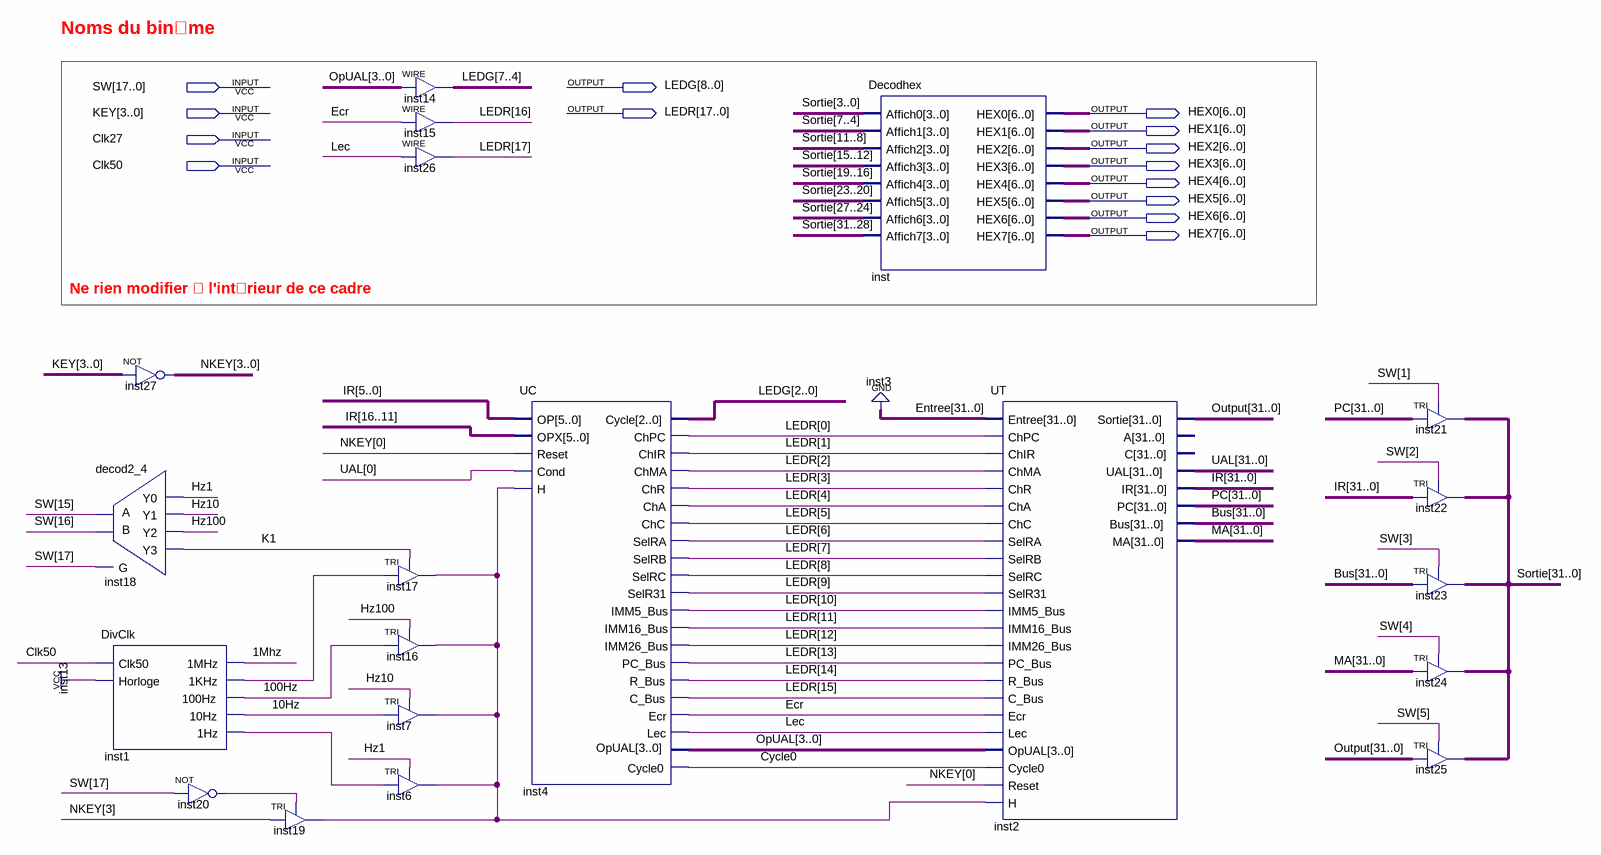
[diagram p0: schematic sheet]
// Quartus schematic DE2_backup.bdf as structural Verilog: 20 symbols, 14 pins
module DE2_backup (
  input  [17:0] SW,
  input  [3:0] KEY,
  input  Clk27,
  input  Clk50,
  output [8:0] LEDG,
  output [17:0] LEDR,
  output [6:0] HEX0,
  output [6:0] HEX1,
  output [6:0] HEX2,
  output [6:0] HEX3,
  output [6:0] HEX4,
  output [6:0] HEX5,
  output [6:0] HEX6,
  output [6:0] HEX7
);

  wire \1Mhz , \10Hz , \100Hz , Cycle0, Ecr, Hz1, Hz10, Hz100, inst1_1hz, inst1_1khz, inst19_out, inst20_out,
       K1, Lec;
  wire [3:0] NKEY, OpUAL;
  wire [31:0] Bus, IR, MA, Output, PC, Sortie, UAL;

  decod2_4 inst18 (.G(SW[17]), .A(SW[15]), .B(SW[16]), .Y0(Hz1), .Y1(Hz10), .Y2(Hz100), .Y3(K1));
  DivClk inst1 (
    .Clk50(Clk50), .Horloge(1'b1), .\1MHz (\1Mhz ), .\1KHz (inst1_1khz), .\100Hz (\100Hz ), .\10Hz (\10Hz ),
    .\1Hz (inst1_1hz));
  assign NKEY = ~KEY;  // NOT inst27, 4 bits wide
  not inst20 (inst20_out, SW[17]);
  TRI inst19 (.IN(NKEY[3]), .OE(inst20_out), .OUT(inst19_out));
  TRI inst17 (.IN(inst1_1khz), .OE(K1), .OUT(inst19_out));
  TRI inst16 (.IN(\100Hz ), .OE(Hz100), .OUT(inst19_out));
  TRI inst7 (.IN(\10Hz ), .OE(Hz10), .OUT(inst19_out));
  TRI inst6 (.IN(inst1_1hz), .OE(Hz1), .OUT(inst19_out));
  assign LEDG[7:4] = OpUAL;  // WIRE inst14
  assign LEDR[16] = Ecr;  // WIRE inst15
  assign LEDR[17] = Lec;  // WIRE inst26
  UC inst4 (
    .Reset(NKEY[0]), .Cond(UAL[0]), .H(inst19_out), .OP(IR[5:0]), .OPX(IR[16:11]), .ChPC(LEDR[0]),
    .ChIR(LEDR[1]), .ChMA(LEDR[2]), .ChR(LEDR[3]), .ChA(LEDR[4]), .ChC(LEDR[5]), .SelRA(LEDR[6]),
    .SelRB(LEDR[7]), .SelRC(LEDR[8]), .SelR31(LEDR[9]), .IMM5_Bus(LEDR[10]), .IMM16_Bus(LEDR[11]),
    .IMM26_Bus(LEDR[12]), .PC_Bus(LEDR[13]), .R_Bus(LEDR[14]), .C_Bus(LEDR[15]), .Ecr(Ecr), .Lec(Lec),
    .Cycle0(Cycle0), .Cycle(LEDG[2:0]), .OpUAL(OpUAL));
  Decodhex inst (
    .Affich0(Sortie[3:0]), .Affich1(Sortie[7:4]), .Affich2(Sortie[11:8]), .Affich3(Sortie[15:12]),
    .Affich4(Sortie[19:16]), .Affich5(Sortie[23:20]), .Affich6(Sortie[27:24]), .Affich7(Sortie[31:28]),
    .HEX0(HEX0), .HEX1(HEX1), .HEX2(HEX2), .HEX3(HEX3), .HEX4(HEX4), .HEX5(HEX5), .HEX6(HEX6), .HEX7(HEX7));
  UT inst2 (
    .Entree({32{1'b0}}), .ChPC(LEDR[0]), .ChIR(LEDR[1]), .ChMA(LEDR[2]), .ChR(LEDR[3]), .ChA(LEDR[4]),
    .ChC(LEDR[5]), .SelRA(LEDR[6]), .SelRB(LEDR[7]), .SelRC(LEDR[8]), .SelR31(LEDR[9]), .IMM5_Bus(LEDR[10]),
    .IMM16_Bus(LEDR[11]), .IMM26_Bus(LEDR[12]), .PC_Bus(LEDR[13]), .R_Bus(LEDR[14]), .C_Bus(LEDR[15]),
    .Ecr(Ecr), .Lec(Lec), .OpUAL(OpUAL), .Cycle0(Cycle0), .Reset(NKEY[0]), .H(inst19_out), .Sortie(Output),
    .UAL(UAL), .IR(IR), .PC(PC), .MA(MA), .Bus(Bus));  // open: A, C
  TRI inst21[31:0] (.IN(PC), .OE(SW[1]), .OUT(Sortie));
  TRI inst22[31:0] (.IN(IR), .OE(SW[2]), .OUT(Sortie));
  TRI inst23[31:0] (.IN(Bus), .OE(SW[3]), .OUT(Sortie));
  TRI inst24[31:0] (.IN(MA), .OE(SW[4]), .OUT(Sortie));
  TRI inst25[31:0] (.IN(Output), .OE(SW[5]), .OUT(Sortie));

  // Notes on the sheet:
  //   Noms du bin�me
  //   Ne rien modifier � l'int�rieur de ce cadre
endmodule
